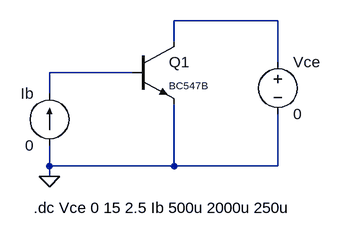
[diagram p0: schematic DC Sweep BC547B.asc]
DC Sweep BC547B.asc, the LTspice schematic file:
Version 4
SHEET 1 1300 680
WIRE 384 48 224 48
WIRE 224 80 224 48
WIRE 384 112 384 48
WIRE 160 128 32 128
WIRE 32 160 32 128
WIRE 32 272 32 240
WIRE 224 272 224 176
WIRE 224 272 32 272
WIRE 384 272 384 192
WIRE 384 272 224 272
WIRE 32 288 32 272
FLAG 32 288 0
SYMBOL current 32 240 R180
WINDOW 0 24 80 Left 2
WINDOW 3 24 0 Left 2
SYMATTR InstName Ib
SYMATTR Value 0
SYMBOL npn 160 80 R0
WINDOW 3 56 68 Left 1
SYMATTR Value BC547B
SYMATTR InstName Q1
SYMBOL voltage 384 96 R0
SYMATTR InstName Vce
SYMATTR Value 0
TEXT 8 336 Left 2 !.dc Vce 0 15 2.5 Ib 500u 2000u 250u

The netlist it stands for:
* DC Sweep BC547B.asc
Ib 0 N002 0
Q1 N001 N002 0 0 BC547B
Vce N001 0 0
.model NPN NPN
.model PNP PNP
.lib standard.bjt
.dc Vce 0 15 2.5 Ib 500u 2000u 250u
.backanno
.end